# Altium schematic sheet NguyenLi.SchDoc
size A2; SheetNumber: 1; SheetTotal: 1
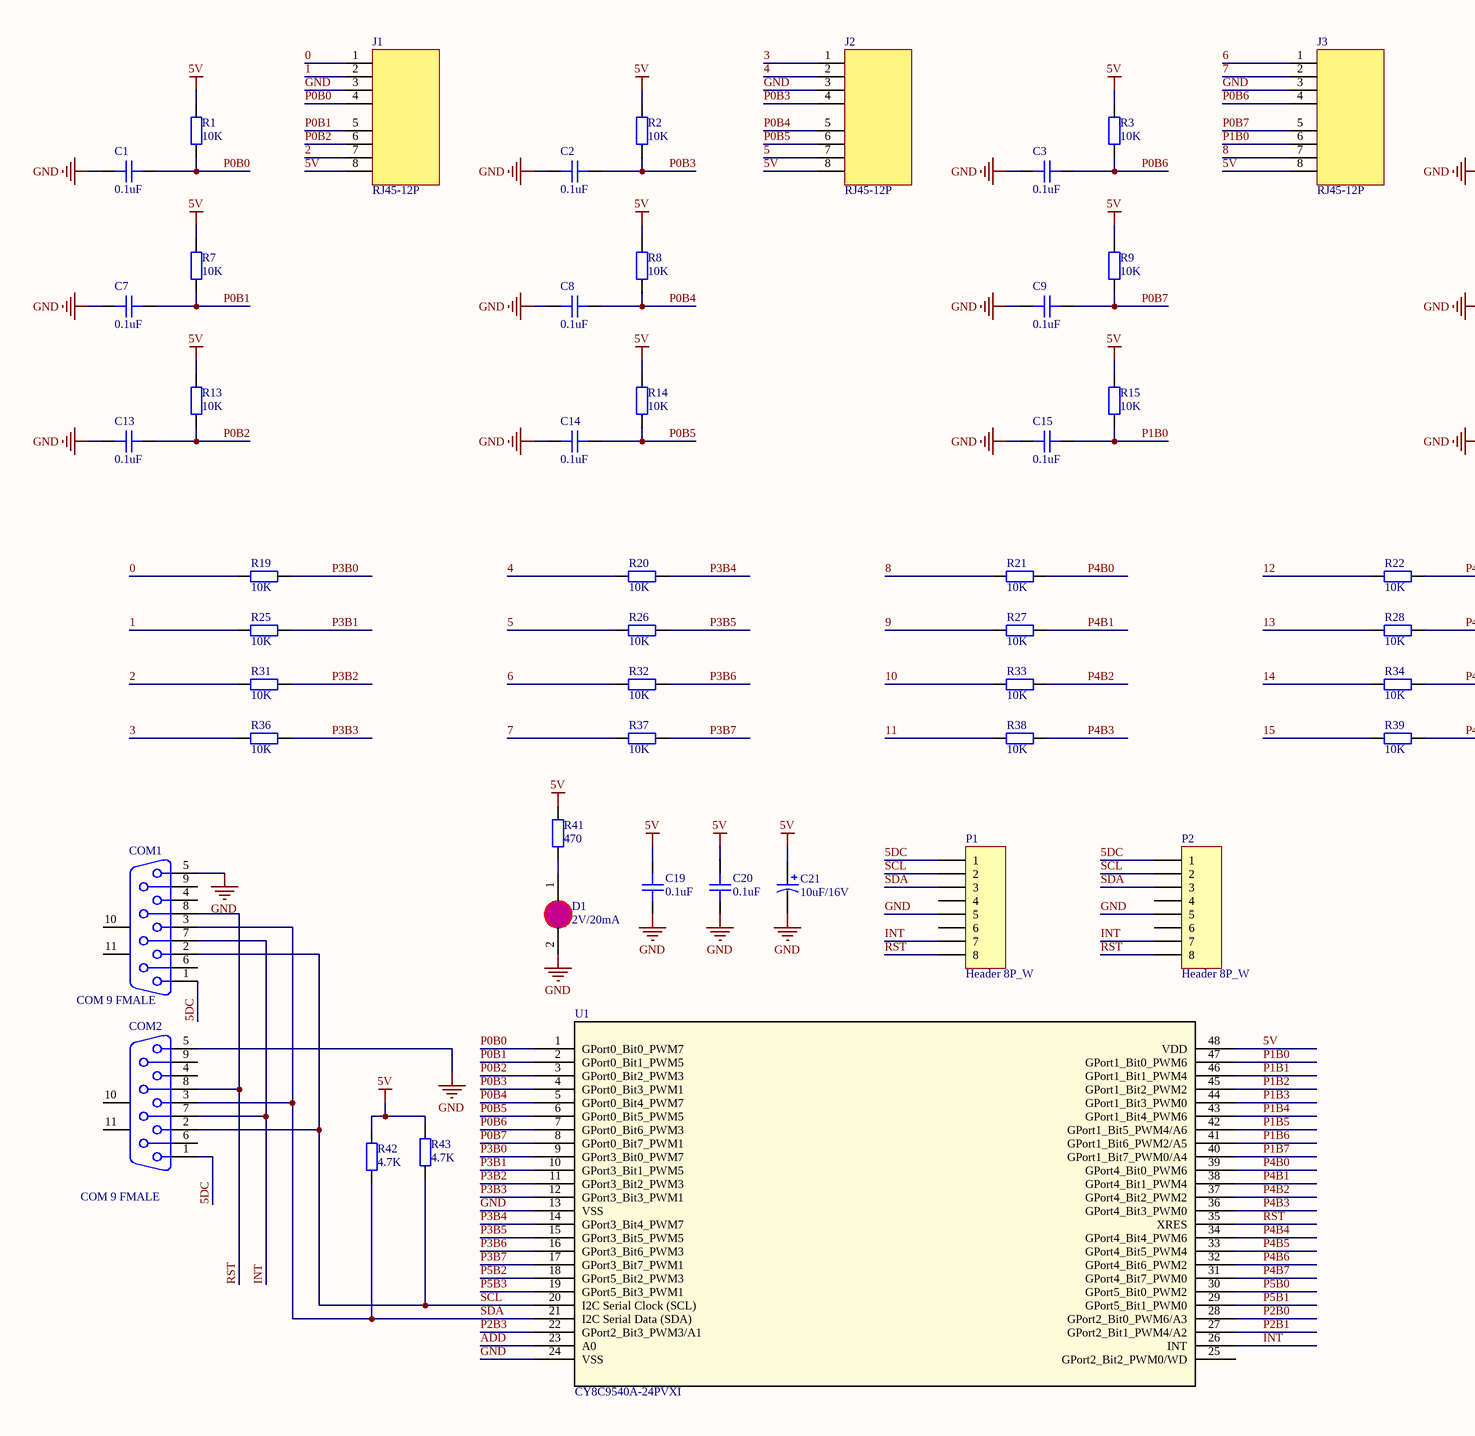
[diagram p0: NguyenLi.SchDoc, left]
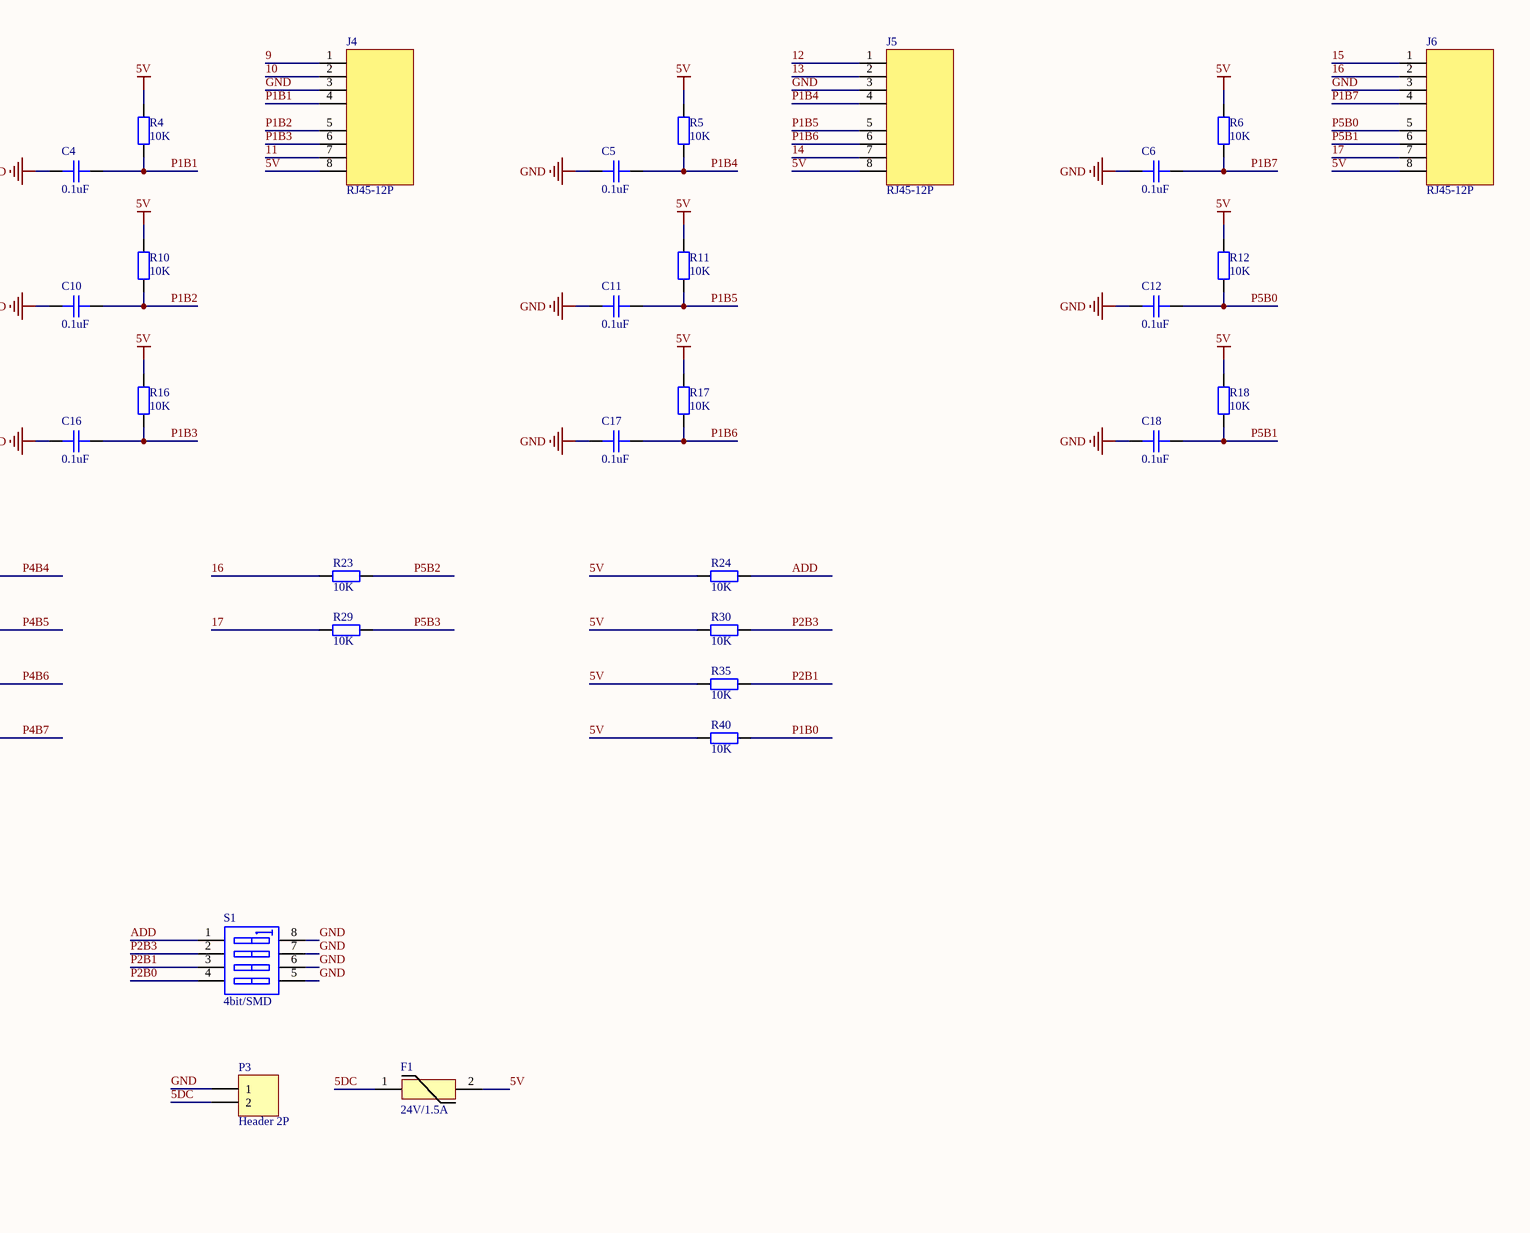
[diagram p1: NguyenLi.SchDoc, right]

## Parts
C1  0.1uF  [CAPC-0603 (1608)]
C2  0.1uF  [CAPC-0603 (1608)]
C3  0.1uF  [CAPC-0603 (1608)]
C4  0.1uF  [CAPC-0603 (1608)]
C5  0.1uF  [CAPC-0603 (1608)]
C6  0.1uF  [CAPC-0603 (1608)]
C7  0.1uF  [CAPC-0603 (1608)]
C8  0.1uF  [CAPC-0603 (1608)]
C9  0.1uF  [CAPC-0603 (1608)]
C10  0.1uF  [CAPC-0603 (1608)]
C11  0.1uF  [CAPC-0603 (1608)]
C12  0.1uF  [CAPC-0603 (1608)]
C13  0.1uF  [CAPC-0603 (1608)]
C14  0.1uF  [CAPC-0603 (1608)]
C15  0.1uF  [CAPC-0603 (1608)]
C16  0.1uF  [CAPC-0603 (1608)]
C17  0.1uF  [CAPC-0603 (1608)]
C18  0.1uF  [CAPC-0603 (1608)]
C19  0.1uF  [CAPC-0603 (1608)]
C20  0.1uF  [CAPC-0603 (1608)]
C21  10uF/16V  [CAP_ALUM_D050_S20_H110]
COM1  COM 9 FMALE  [DSB 9-F]
COM2  COM 9 FMALE  [DSB 9-F]
D1  2V/20mA  [LED_0805_RED]
F1  24V/1.5A  [FUSE_1812(4532)]
J1  RJ45-12P  [RJ45-8PIN_18MM_NO_TRANSFORMER]
J2  RJ45-12P  [RJ45-8PIN_18MM_NO_TRANSFORMER]
J3  RJ45-12P  [RJ45-8PIN_18MM_NO_TRANSFORMER]
J4  RJ45-12P  [RJ45-8PIN_18MM_NO_TRANSFORMER]
J5  RJ45-12P  [RJ45-8PIN_18MM_NO_TRANSFORMER]
J6  RJ45-12P  [RJ45-8PIN_18MM_NO_TRANSFORMER]
P1  Header 8P_W  [HDR1X8 - W]
P2  Header 8P_W  [HDR1X8 - W]
P3  Header 2P  [VH3.96-2P]
R1  10K  [RESC-0603 (1608)]
R2  10K  [RESC-0603 (1608)]
R3  10K  [RESC-0603 (1608)]
R4  10K  [RESC-0603 (1608)]
R5  10K  [RESC-0603 (1608)]
R6  10K  [RESC-0603 (1608)]
R7  10K  [RESC-0603 (1608)]
R8  10K  [RESC-0603 (1608)]
R9  10K  [RESC-0603 (1608)]
R10  10K  [RESC-0603 (1608)]
R11  10K  [RESC-0603 (1608)]
R12  10K  [RESC-0603 (1608)]
R13  10K  [RESC-0603 (1608)]
R14  10K  [RESC-0603 (1608)]
R15  10K  [RESC-0603 (1608)]
R16  10K  [RESC-0603 (1608)]
R17  10K  [RESC-0603 (1608)]
R18  10K  [RESC-0603 (1608)]
R19  10K  [RESC-0603 (1608)]
R20  10K  [RESC-0603 (1608)]
R21  10K  [RESC-0603 (1608)]
R22  10K  [RESC-0603 (1608)]
R23  10K  [RESC-0603 (1608)]
R24  10K  [RESC-0603 (1608)]
R25  10K  [RESC-0603 (1608)]
R26  10K  [RESC-0603 (1608)]
R27  10K  [RESC-0603 (1608)]
R28  10K  [RESC-0603 (1608)]
R29  10K  [RESC-0603 (1608)]
R30  10K  [RESC-0603 (1608)]
R31  10K  [RESC-0603 (1608)]
R32  10K  [RESC-0603 (1608)]
R33  10K  [RESC-0603 (1608)]
R34  10K  [RESC-0603 (1608)]
R35  10K  [RESC-0603 (1608)]
R36  10K  [RESC-0603 (1608)]
R37  10K  [RESC-0603 (1608)]
R38  10K  [RESC-0603 (1608)]
R39  10K  [RESC-0603 (1608)]
R40  10K  [RESC-0603 (1608)]
R41  470  [RESC-0603 (1608)]
R42  4.7K  [RESC-0603 (1608)]
R43  4.7K  [RESC-0603 (1608)]
S1  4bit/SMD  [219-4LPSTR]
U1  CY8C9540A-24PVXI  [SSOP-48]

## Nets
5V: C19.1 C20.2 C21.1 F1.2 J1.8 J2.8 J3.8 J4.8 J5.8 J6.8 R1.2 R2.2 R3.2 R4.2 R5.2 R6.2 R7.2 R8.2 R9.2 R10.2 R11.2 R12.2 R13.2 R14.2 R15.2 R16.2 R17.2 R18.2 R24.1 R30.1 R35.1 R40.1 R41.2 R42.2 R43.2 U1.48(VDD)
GND: C1.1 C2.1 C3.1 C4.1 C5.1 C6.1 C7.1 C8.1 C9.1 C10.1 C11.1 C12.1 C13.1 C14.1 C15.1 C16.1 C17.1 C18.1 C19.2 C20.1 C21.2 COM1.5 COM2.5 D1.2(K) J1.3 J2.3 J3.3 J4.3 J5.3 J6.3 P1.5 P2.5 P3.1 S1.5(B4) S1.6(B3) S1.7(B2) S1.8(B1) U1.13(VSS) U1.24(VSS)
0: J1.1 R19.1
1: J1.2 R25.1
2: J1.7 R31.1
3: J2.1 R36.1
4: J2.2 R20.1
5: J2.7 R26.1
5DC: COM1.1 COM2.1 F1.1 P1.1 P2.1 P3.2
6: J3.1 R32.1
7: J3.2 R37.1
8: J3.7 R21.1
9: J4.1 R27.1
10: J4.2 R33.1
11: J4.7 R38.1
12: J5.1 R22.1
13: J5.2 R28.1
14: J5.7 R34.1
15: J6.1 R39.1
16: J6.2 R23.1
17: J6.7 R29.1
ADD: R24.2 S1.1(A1) U1.23(A0)
INT: COM1.7 COM2.7 P1.7 P2.7 U1.26(INT)
P0B0: C1.2 J1.4 R1.1 U1.1(GPort0_Bit0_PWM7)
P0B1: C7.2 J1.5 R7.1 U1.2(GPort0_Bit1_PWM5)
P0B2: C13.2 J1.6 R13.1 U1.3(GPort0_Bit2_PWM3)
P0B3: C2.2 J2.4 R2.1 U1.4(GPort0_Bit3_PWM1)
P0B4: C8.2 J2.5 R8.1 U1.5(GPort0_Bit4_PWM7)
P0B5: C14.2 J2.6 R14.1 U1.6(GPort0_Bit5_PWM5)
P0B6: C3.2 J3.4 R3.1 U1.7(GPort0_Bit6_PWM3)
P0B7: C9.2 J3.5 R9.1 U1.8(GPort0_Bit7_PWM1)
P1B0: C15.2 J3.6 R15.1 R40.2 U1.47(GPort1_Bit0_PWM6)
P1B1: C4.2 J4.4 R4.1 U1.46(GPort1_Bit1_PWM4)
P1B2: C10.2 J4.5 R10.1 U1.45(GPort1_Bit2_PWM2)
P1B3: C16.2 J4.6 R16.1 U1.44(GPort1_Bit3_PWM0)
P1B4: C5.2 J5.4 R5.1 U1.43(GPort1_Bit4_PWM6)
P1B5: C11.2 J5.5 R11.1 U1.42(GPort1_Bit5_PWM4/A6)
P1B6: C17.2 J5.6 R17.1 U1.41(GPort1_Bit6_PWM2/A5)
P1B7: C6.2 J6.4 R6.1 U1.40(GPort1_Bit7_PWM0/A4)
P2B0: S1.4(A4) U1.28(GPort2_Bit0_PWM6/A3)
P2B1: R35.2 S1.3(A3) U1.27(GPort2_Bit1_PWM4/A2)
P2B3: R30.2 S1.2(A2) U1.22(GPort2_Bit3_PWM3/A1)
P3B0: R19.2 U1.9(GPort3_Bit0_PWM7)
P3B1: R25.2 U1.10(GPort3_Bit1_PWM5)
P3B2: R31.2 U1.11(GPort3_Bit2_PWM3)
P3B3: R36.2 U1.12(GPort3_Bit3_PWM1)
P3B4: R20.2 U1.14(GPort3_Bit4_PWM7)
P3B5: R26.2 U1.15(GPort3_Bit5_PWM5)
P3B6: R32.2 U1.16(GPort3_Bit6_PWM3)
P3B7: R37.2 U1.17(GPort3_Bit7_PWM1)
P4B0: R21.2 U1.39(GPort4_Bit0_PWM6)
P4B1: R27.2 U1.38(GPort4_Bit1_PWM4)
P4B2: R33.2 U1.37(GPort4_Bit2_PWM2)
P4B3: R38.2 U1.36(GPort4_Bit3_PWM0)
P4B4: R22.2 U1.34(GPort4_Bit4_PWM6)
P4B5: R28.2 U1.33(GPort4_Bit5_PWM4)
P4B6: R34.2 U1.32(GPort4_Bit6_PWM2)
P4B7: R39.2 U1.31(GPort4_Bit7_PWM0)
P5B0: C12.2 J6.5 R12.1 U1.30(GPort5_Bit0_PWM2)
P5B1: C18.2 J6.6 R18.1 U1.29(GPort5_Bit1_PWM0)
P5B2: R23.2 U1.18(GPort5_Bit2_PWM3)
P5B3: R29.2 U1.19(GPort5_Bit3_PWM1)
RST: COM1.8 COM2.8 P1.8 P2.8 U1.35(XRES)
SCL: COM1.2 COM2.2 P1.2 P2.2 R43.1 U1.20(I2C_Serial_Clock_(SCL))
SDA: COM1.3 COM2.3 P1.3 P2.3 R42.1 U1.21(I2C_Serial_Data_(SDA))
NetD1_1: D1.1(A) R41.1

Not connected (* = marked no-connect by the designer): COM1 4 6 9 10(MH1) 11(MH2); COM2 4 6 9 10(MH1) 11(MH2); P1 4 6; P2 4 6; U1 25(GPort2_Bit2_PWM0/WD)

## Library data of the parts
C1-C20 = C0603C104K5RACTU: CAP CER 0.1uF 50V 10% X7R 0603; CompanyID: VT-00982; Solder: SMT; Value: 104/50V; MPN: C0603C104K5RACTU; Category: CAPACITOR; PinCount: 2
C21 = 106CKR050M: CAP ALUM 10uF 50V 20% RADIAL; Value: 106/50V; Solder: WAVE; CompanyID: VT-00054; MPN: 106CKR050M; Category: CAPACITOR; PinCount: 2
COM1 COM2 = DSB9F: COM 9; PackageDocument: O; Positions: 9; Gender: Receptacle; Value: COM 9; Published: 15-Jun-2001; LatestRevisionDate: 17-Jul-2002; LatestRevisionNote: Re-released for DXP Platform.; DatasheetDocument: 1-Sep-1999; PackageReference: 788750; Publisher: Altium Limited; Orientation: Right Angle
D1 = 17-215SURC/S530-A3/TR8: LED RED CLEAR 0805 SMD; Solder: SMT; CompanyID: VT-00379; Value: 2V/20mA; MPN: 17-215SURC/S530-A3/TR8
F1 = 1812L150/24MR: FUSE PTC RESETTABLE 24V 1.50A 1812L; Solder: SMT; CompanyID: VT-00870; MPN: 1812L150/24MR; Value: 24V/1.5A
J1-J6 = RJ45-12PIN_NO_TRANSFORMER: Solder: WAVE
P1 P2 = Header 8x1: Header, 8 Pin Pitch 2.54mm; Solder: WAVE; Value: Header 8P_W
P3 = VH3.96-2P: Header, 2 Pin Pitch 3.96mm; Solder: WAVE; Value: Header 2P; MPN: VH3.96-2P
R1-R40 = RC0603FR-0710KL: RES SMD 10K OHM 1% 1/10W 0603; CompanyID: VT-00328; Solder: SMT; MPN: RC0603FR-0710KL; Value: 10K; Category: RESISTOR
R41-R43 = RC0603FR-07470RL: RES SMD 470 OHM 1% 1/10W 0603; Value: 470R; Solder: SMT; CompanyID: VT-01176; MPN: RC0603FR-07470RL; Category: RESISTOR
S1 = 219-4LPSTR: SWITCH SLIDE DIP SPST 100MA 20V; CompanyID: VT-xxxx; Solder: SMT; MPN: 219-4LPSTR; Value: 4bit/SMD
U1 = CY8C9540A-24PVXI: No Description Available; Mfr_Name: Cypress Semiconductor; Digi-Key_Part_Number_3: 2156-CY8C9540A-24PVXI-ND; Digi-Key_Part_Number_2: 428-2016-5-ND; Digi-Key_Part_Number_1: 2015-CY8C9540A-24PVXI-ND; RefDes: RefDes; Type: Type